# EAGLE design Battery pack (EAGLE 9.6.2)
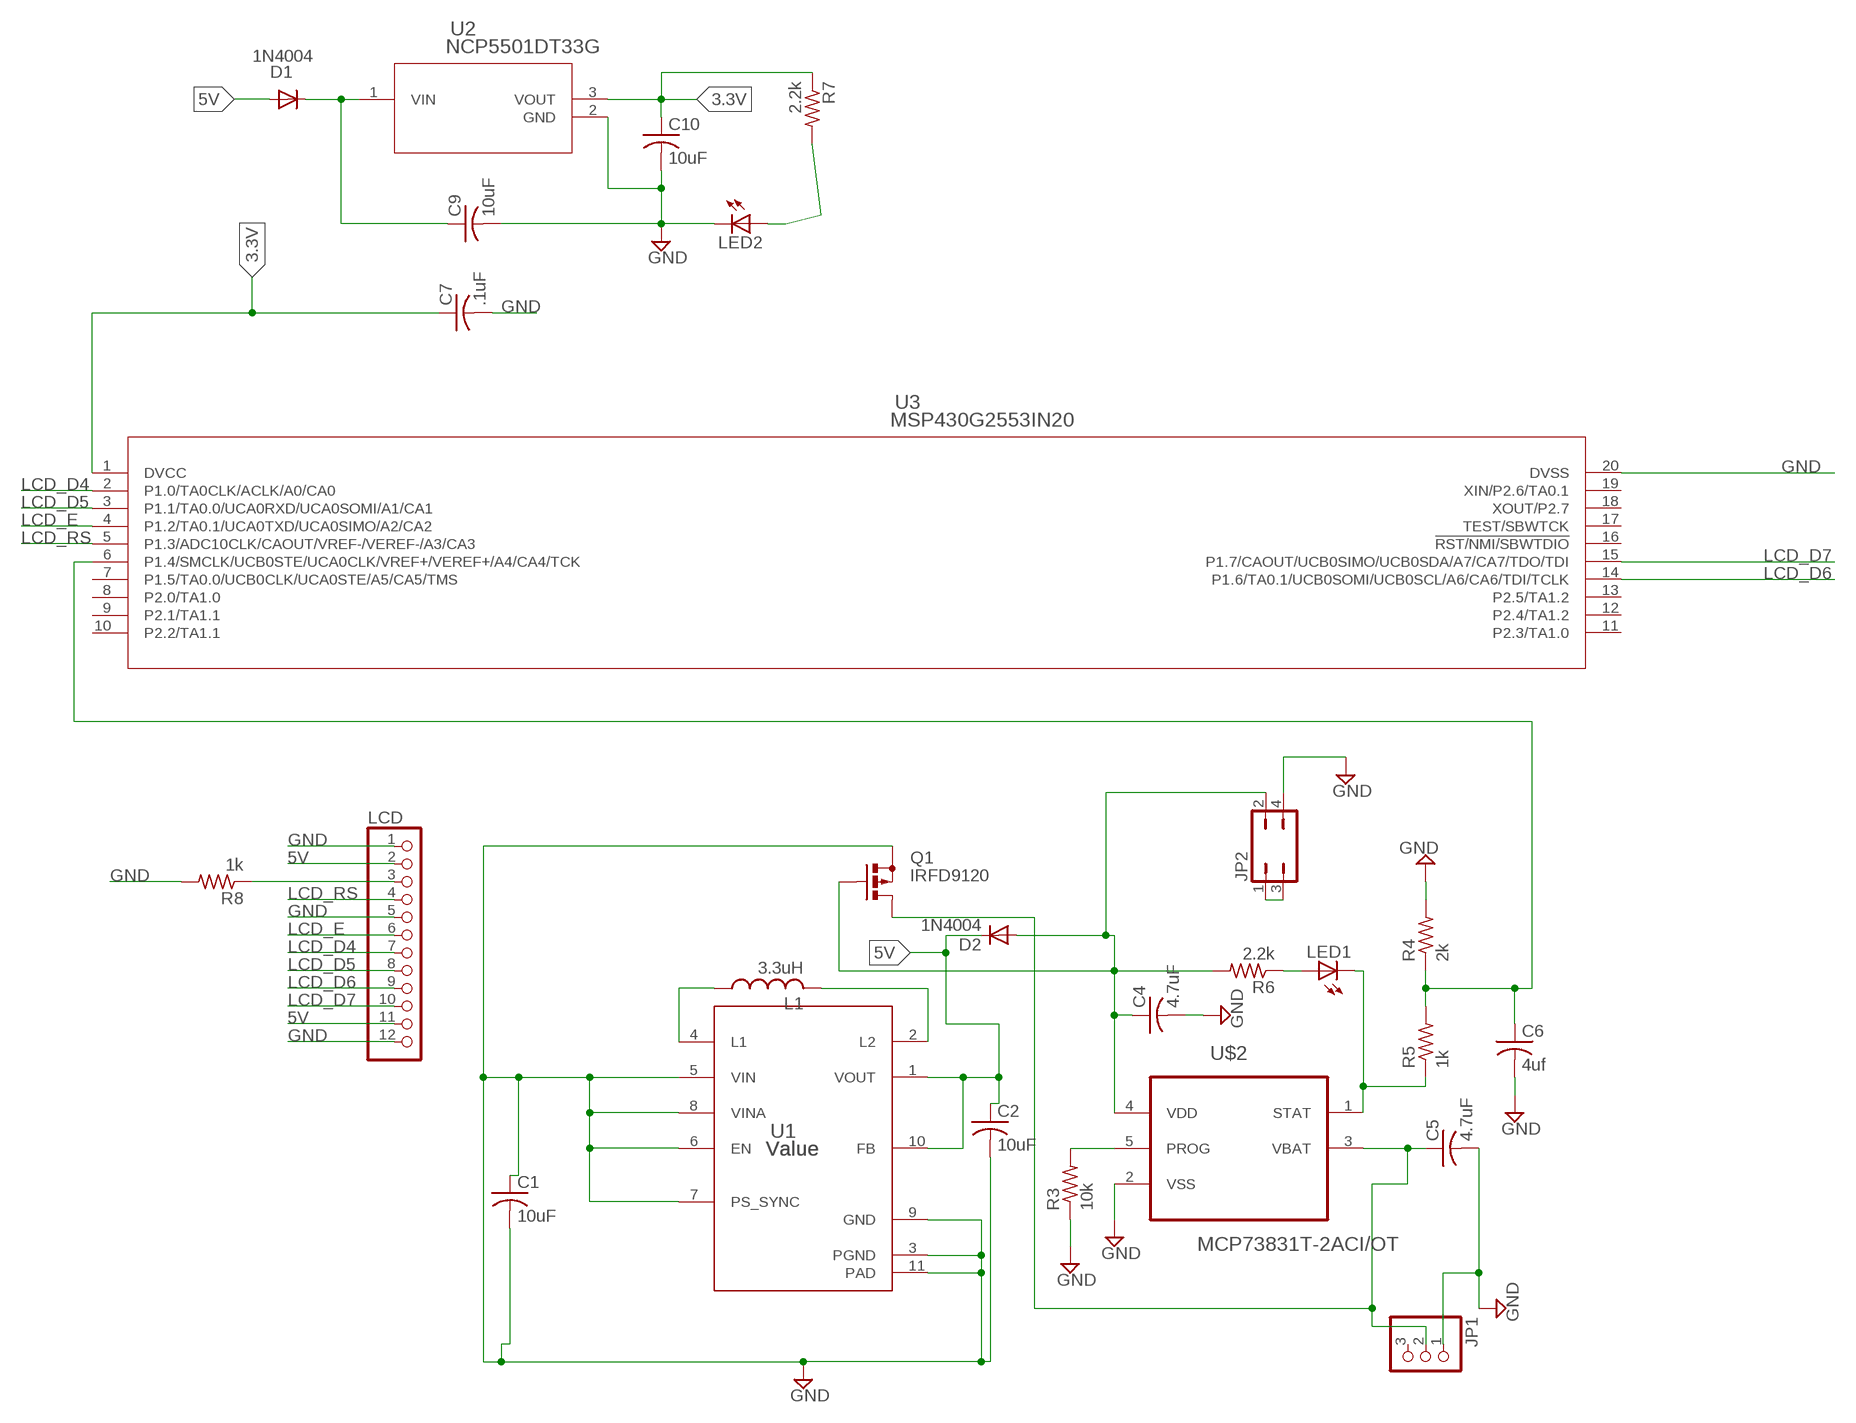
[diagram p0: schematic, sheet 1]

## Parts
C1  10uF  C-US150-064X183  [C150-064X183]
C2  10uF  C-US150-064X183  [C150-064X183]
C4  4.7uF  C-US150-064X183  [C150-064X183]
C5  4.7uF  C-US150-064X183  [C150-064X183]
C6  4uf  C-US150-064X183  [C150-064X183]
C7  .1uF  C-US150-064X183  [C150-064X183]
C9  10uF  C-US150-064X183  [C150-064X183]
C10  10uF  C-US150-064X183  [C150-064X183]
D1  1N4004  [DO41-10]
D2  1N4004  [DO41-10]
JP1  PINHD-1X3  [1X03]
JP2  JP2Q  [JP2Q]
L1  3.3uH  L-US0207/15  [0207/15]
LCD  PINHD-1X12  [1X12]
LED1  LEDB155  [Q62902-B155]
LED2  LEDB155  [Q62902-B155]
Q1  IRFD9120  [C370-01]
R3  10k  R-US_0207/15  [0207/15]
R4  2k  R-US_0207/15  [0207/15]
R5  1k  R-US_0207/15  [0207/15]
R6  2.2k  R-US_0207/15  [0207/15]
R7  2.2k  R-US_0207/15  [0207/15]
R8  1k  R-US_0207/15  [0207/15]
U1  Value  TPS63002DRCR  [DRC0010J]
U2  NCP5501DT33G  [DPAK-3_ONS]
U3  MSP430G2553IN20  [N20_TEX]
U$2  MCP73831T-2ACI/OT  [SOT95P280X145-5N]

## Nets
3.3V: C7.1 C10.1 R7.1 U2.3(VOUT) U3.1(DVCC)
5V: C2.1 D1.A D2.C LCD.2 LCD.11 U1.1(VOUT) U1.10(FB)
GND: C1.1 C1.2 C2.2 C4.2 C5.2 C6.2 C7.2 C9.2 C10.2 JP1.1 JP2.4 LCD.1 LCD.5 LCD.12 LED2.K(C) Q1.S R3.1 R4.2 R8.2 U1.3(PGND) U1.5(VIN) U1.6(EN) U1.7(PS_SYNC) U1.8(VINA) U1.9(GND) U1.11(PAD) U2.2(GND) U3.20(DVSS) U$2.2(VSS)
LCD_D4: LCD.7 U3.2(P1.0/TA0CLK/ACLK/A0/CA0)
LCD_D5: LCD.8 U3.3(P1.1/TA0.0/UCA0RXD/UCA0SOMI/A1/CA1)
LCD_D6: LCD.9 U3.14(P1.6/TA0.1/UCB0SOMI/UCB0SCL/A6/CA6/TDI/TCLK)
LCD_D7: LCD.10 U3.15(P1.7/CAOUT/UCB0SIMO/UCB0SDA/A7/CA7/TDO/TDI)
LCD_E: LCD.6 U3.4(P1.2/TA0.1/UCA0TXD/UCA0SIMO/A2/CA2)
LCD_RS: LCD.4 U3.5(P1.3/ADC10CLK/CAOUT/VREF-/VEREF-/A3/CA3)
N$1: L1.1 U1.4(L1)
N$2: C4.1 D2.A JP2.2 Q1.G R6.2 U$2.4(VDD)
N$3: JP2.1 JP2.3
N$4: L1.2 U1.2(L2)
N$6: C9.1 D1.C U2.1(VIN)
N$8: R3.2 U$2.5(PROG)
N$9: LED1.K(C) R5.1 U$2.1(STAT)
N$11: C6.1 R4.1 R5.2 U3.6(P1.4/SMCLK/UCB0STE/UCA0CLK/VREF+/VEREF+/A4/CA4/TCK)
N$12: LED1.A R6.1
N$14: C5.1 JP1.2 Q1.D Q1.D1(D) U$2.3(VBAT)
N$15: LED2.A R7.2
N$18: LCD.3 R8.1
Unconnected: JP1.3 U3.7(P1.5/TA0.0/UCB0CLK/UCA0STE/A5/CA5/TMS) U3.8(P2.0/TA1.0) U3.9(P2.1/TA1.1) U3.10(P2.2/TA1.1) U3.11(P2.3/TA1.0) U3.12(P2.4/TA1.2) U3.13(P2.5/TA1.2) U3.16(!RST/NMI/SBWTDIO) U3.17(TEST/SBWTCK) U3.18(XOUT/P2.7) U3.19(XIN/P2.6/TA0.1)

## Library data of the parts
C1 C2 C4-C7 C9 C10 = adafruit:C-US: CAPACITOR, American symbol
D1 D2 = adafruit:1N4004: DIODE General purpose 1N400x type rectifier (With bigger pads) http://www.ladyada.net/library/pcb/eaglelibrary.html
JP1 = adafruit:PINHD-1X3: PIN HEADER
JP2 = jumper:JP2Q: JUMPER
L1 = rcl:L-US: INDUCTOR, American symbol; SPICEPREFIX: L
LCD = adafruit:PINHD-1X12: PIN HEADER
LED1 LED2 = adafruit:LED: LED OSRAM: - CHIPLED LG R971, LG N971, LY N971, LG Q971, LY Q971, LO R971, LY R971 LH N974, LH R974 LS Q976, LO Q976, LY Q976 LO Q996 - Hyper CHIPLED LW Q18S LB Q993, LB Q99A, LB R99A - SideLED LS A670, LO A670, LY A670, LG A670, LP A670 LB A673, LV A673, LT A673, LW A673 LH A674 LY A675 LS A676, LA A676, LO A676, LY A676, LW A676 LS A679, LY A679, LG A679 - Hyper Micro SIDELED® LS Y876, LA Y876, LO Y876, LY Y876 LT Y87S - SmartLED LW L88C, LW L88S LB L89C, LB L89S, LG L890 LS L89K, LO L89K, LY L89K LS L896, LA L896, LO L896, LY L896 - TOPLED LS T670, LO T670, LY T670, LG T670, LP T670 LSG T670, LSP T670, LSY T670, LOP T670, LYG T670 LG T671, LOG T671, LSG T671 LB T673, LV T673, LT T673, LW T673 LH T674 LS T676, LA T676, LO T676, LY T676, LB T676, LH T676, LSB T676, LW T676 LB T67C, LV T67C, LT T67C, LS T67K, LO T67K, LY T67K, LW E67C LS E67B, LA E67B, LO E67B, LY E67B, LB E67C, LV E67C, LT E67C LW T67C LS T679, LY T679, LG T679 LS T770, LO T770, LY T770, LG T770, LP T770 LB T773, LV T773, LT T773, LW T773 LH T774 LS E675, LA E675, LY E675, LS T675 LS T776, LA T776, LO T776, LY T776, LB T776 LHGB T686 LT T68C, LB T68C - Hyper Mini TOPLED® LB M676 - Mini TOPLED Santana® LG M470 LS M47K, LO M47K, LY M47K Source: http://www.osram.convergy.de/
Q1 = transistor-small-signal:IRFD9120: P-CHANNEL MOS FET
R3-R8 = adafruit:R-US_: RESISTOR, American symbol
U1 = tps63002x:TPS63002DRCR; ALTERNATE_PARTNUMBER: TPS63002DRCT; APPLICATION_BUILDNUMBER: *; COMPTYPE: IC; MANUFACTURER: Texas Instruments; MOUNTTYPE: SMT; PACKAGEREFERENCE: DRC0010J; PARTNUMBER: TPS63002DRCR; PIN_COUNT: 11; REFDES: RefDes; ROHS: Y; TYPE: TYPE
U2 = NCP5501DT33G:NCP5501DT33G; COPYRIGHT: Copyright (C) 2016 Accelerated Designs. All rights reserved; MANUFACTURER_PART_NUMBER: NCP5501DT33G; SOURCELIBRARY: ONSemi_2017-12-12_4; VENDOR: ON Semiconductor
U3 = msp32pin:MSP430G2553IN20; BUILT_BY: EMA_UL_Team; MANUFACTURER_PART_NUMBER: MSP430G2553IN20; SOURCELIBRARY: TI_2016-12-05; VENDOR: Texas Instruments
U$2 = MCP73831T-2ACI_OT:MCP73831T-2ACI/OT: Charge Management Controller Check prices <https://pricing.snapeda.com/search/part/MCP73831T-2ACI/OT/?ref=eda>; AVAILABILITY: Good; DESCRIPTION: Charger IC Lithium Ion/Polymer SOT-23-5; MF: Microchip; MP: MCP73831T-2ACI/OT; PACKAGE: SOT-23 Microchip; PRICE: None; PURCHASE-URL: https://pricing.snapeda.com/search/part/MCP73831T-2ACI/OT/?ref=eda

## Board
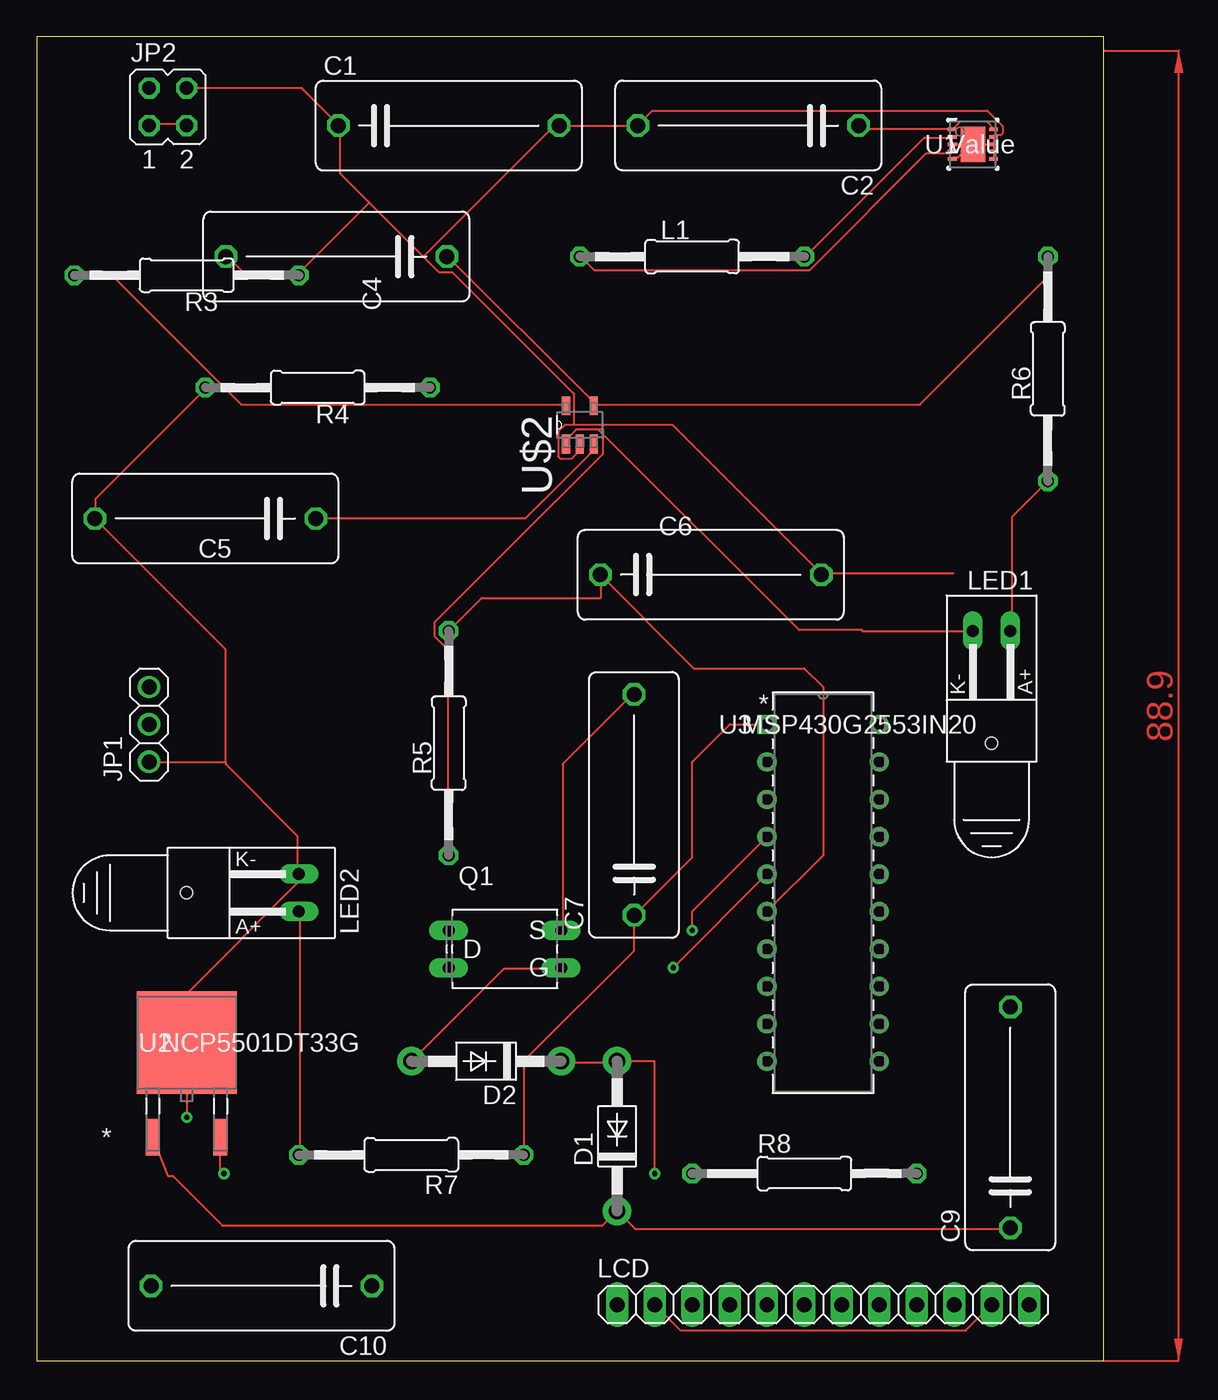
[diagram p1: board, top side]
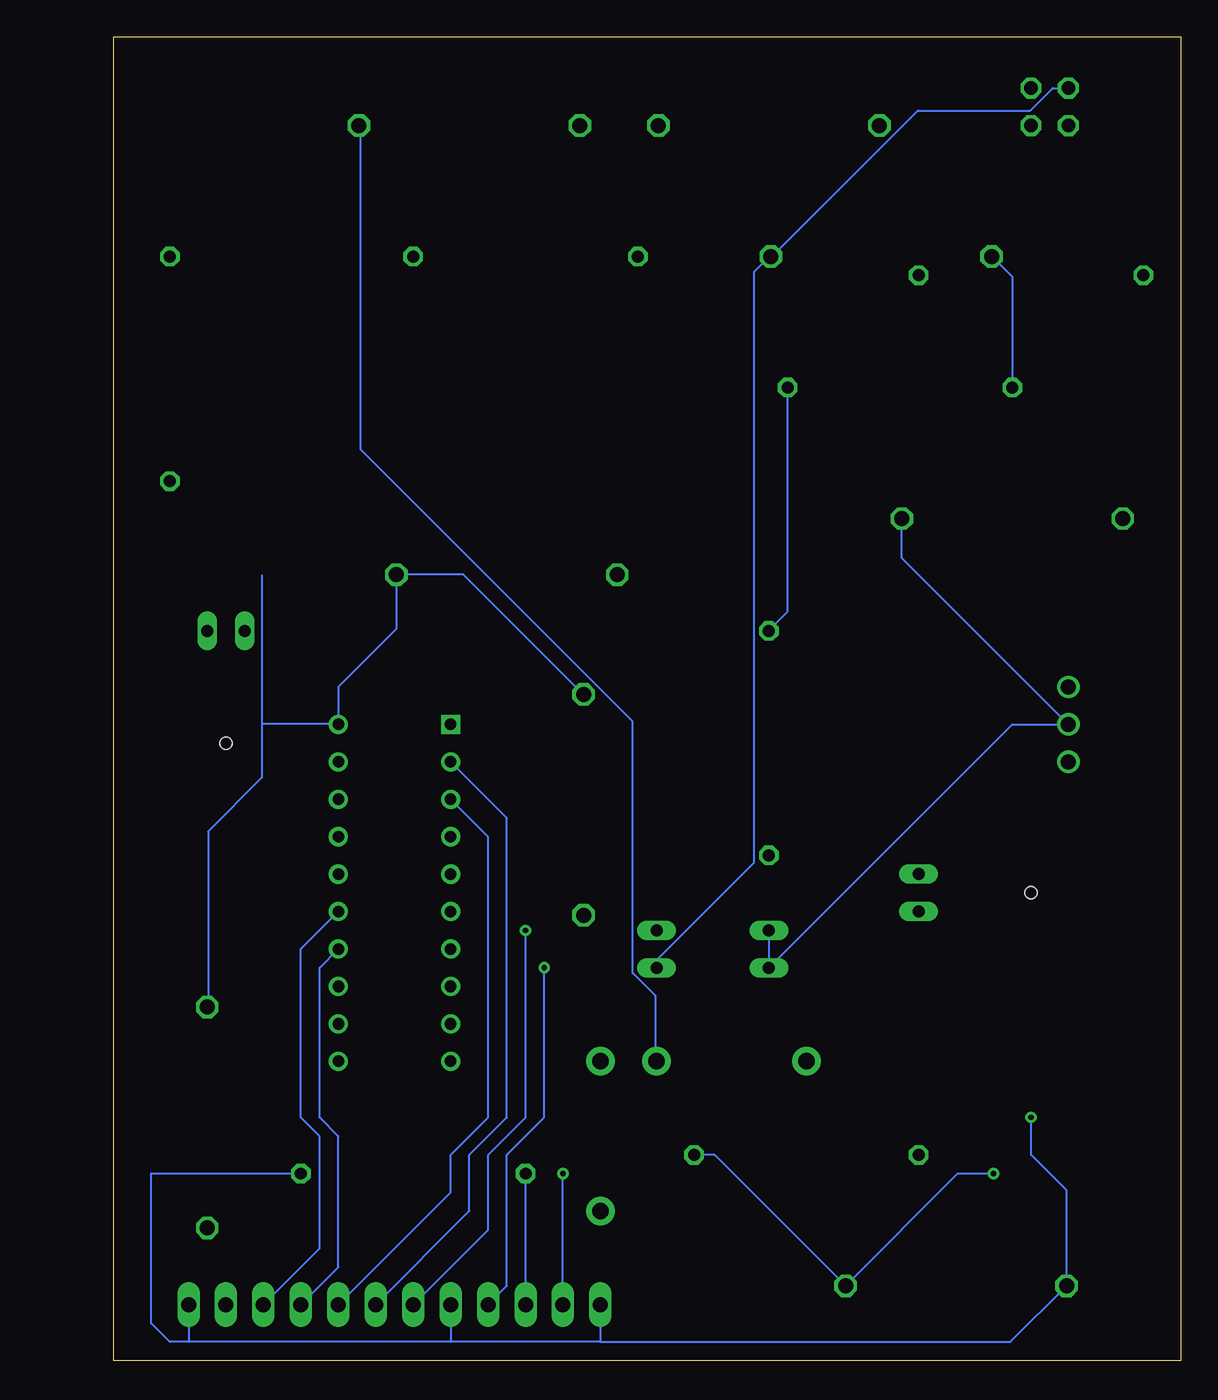
[diagram p2: board, bottom side, seen from below]

Size 72.37 x 89.84 mm. Coordinates in mm from the lower left corner, seen from the top.
Outline: 0,0 72.37,0 72.37,89.84 0,89.84 0,0
Copper layers (1*16): Top 0.035mm / dielectric 1.5mm / Bottom 0.035mm
Design rules "default": minimum track width 6mil, minimum drill 0.35mm, track to track 6mil, track to pad 6mil, pad to pad 6mil, via to via 6mil, smd to smd 6mil, copper to edge 40mil, drill to drill 6mil, minimum pad ring 10mil, minimum via ring 8mil, stop-mask expansion 4mil, vias tented up to drill 0mil, thermal gap 10mil

### Footprints (pad centres in the part's own frame; a part is rotated, then mirrored left to right if it is on the bottom)
C150-064X183 = drill 1.016 octagon: 1 -7.493,0; 2 7.493,0
DO41-10 = drill 1.118 pad 1.93: A 5.08,0; C -5.08,0
1X03 = drill 1.016: 1 -2.54,0; 2 0,0; 3 2.54,0
JP2Q = drill 0.914 octagon: 1 -1.27,-1.27; 2 -1.27,1.27; 3 1.27,-1.27; 4 1.27,1.27
0207/15 = drill 0.813 octagon: 1 -7.62,0; 2 7.62,0
1X12 = drill 1.016 long: 1 -13.97,0; 2 -11.43,0; 3 -8.89,0; 4 -6.35,0; 5 -3.81,0; 6 -1.27,0; 7 1.27,0; 8 3.81,0; 9 6.35,0; 10 8.89,0; 11 11.43,0; 12 13.97,0
Q62902-B155 = drill 0.813 long: A 7.62,-1.27; K 7.62,1.27 | hole 0.813: 0,0
C370-01 = drill 0.813 long: D -3.81,1.27; D1 -3.81,-1.27; G 3.81,-1.27; S 3.81,1.27
DRC0010J = smd 0.6 x 0.24: 1 -1.4,1; 2 -1.4,0.5; 3 -1.4,0; 4 -1.4,-0.5; 5 -1.4,-1; 6 1.4,-1; 7 1.4,-0.5; 8 1.4,0; 9 1.4,0.5; 10 1.4,1 | smd 1.65 x 2.4: 11 0,0 | smd 0.5 x 0.5: V 0,-0.95
DPAK-3_ONS = smd 0.94 x 2.489: 1 -2.29,-6.413; 3 2.29,-6.413 | smd 6.782 x 6.934: 2 0,0
N20_TEX = drill 0.787 pad 1.295 square: 1 0,0 | drill 0.787 pad 1.295: 2 0,-2.54; 3 0,-5.08; 4 0,-7.62; 5 0,-10.16; 6 0,-12.7; 7 0,-15.24; 8 0,-17.78; 9 0,-20.32; 10 0,-22.86; 11 7.62,-22.86; 12 7.62,-20.32; 13 7.62,-17.78; 14 7.62,-15.24; 15 7.62,-12.7; 16 7.62,-10.16; 17 7.62,-7.62; 18 7.62,-5.08; 19 7.62,-2.54; 20 7.62,0
SOT95P280X145-5N = smd 1.27 x 0.559: 1 -1.295,0.94; 2 -1.295,0; 3 -1.295,-0.94; 4 1.295,-0.94; 5 1.295,0.94

### Placement (x,y rotation side)
C1  27.94,83.82 0 top
C2  48.26,83.82 180 top
C4  20.32,74.93 180 top
C5  11.43,57.15 180 top
C6  45.72,53.34 0 top
C7  40.51,37.72 90 top
C9  66.04,16.51 90 top
C10  15.24,5.08 180 top
D1  39.37,15.24 90 top
D2  30.48,20.32 180 top
JP1  7.62,43.18 90 top
JP2  8.89,85.09 0 top
L1  44.45,74.93 0 top
LCD  53.34,3.81 0 top
LED1  64.77,41.91 90 top
LED2  10.16,31.75 0 top
Q1  31.75,27.94 0 top
R3  10.16,73.66 180 top
R4  19.05,66.04 180 top
R5  27.94,41.91 90 top
R6  68.58,67.31 90 top
R7  25.4,13.97 180 top
R8  52.07,12.7 0 top
U1  63.5,82.55 0 top
U2  10.16,21.59 0 top
U3  49.53,43.18 0 top
U$2  36.83,63.5 90 top

### Tracks (layer width: path | path; a pad name or v marks a point on that pad's centre or on a via)
3.3V  (via drill 0.35)
  Top 0.152: R7.1 33.07,13.97 33.07,20.37 40.51,27.81 C7.1 44.45,34.16 44.45,40.64 46.99,43.18 U3.1 | v12.7,12.7 12.45,12.95 U2.3
  Bottom 0.152: R7.1 31.62,13.97 C10.1 15.11,12.7 v12.7,12.7
5V  (via drill 0.35)
  Top 0.152: D2.C 35.66,20.22 39.27,20.22 D1.A 41.91,20.32 v41.91,12.7 | LCD.2 43.66,2.06 63.02,2.06 LCD.11 | U1.10 64.92,83.62 64.47,84.07 62.64,84.07 62.18,83.62 U1.1 62.03,83.62 55.93,83.62 55.78,83.77 C2.1
  Bottom 0.152: D2.C 35.66,20.37 35.66,24.79 37.19,26.31 37.19,43.38 55.63,61.82 55.63,83.77 C2.1 | LCD.2 v41.91,12.7
GND  (via drill 0.35)
  Top 0.152: 36.42,63.5 43.13,63.5 53.19,53.44 C6.2 53.34,53.44 62.18,53.44 | 36.42,63.5 35.81,63.5 35.36,63.04 35.36,61.37 35.51,61.21 36.27,61.21 36.73,61.67 36.73,62.13 U$2.2 | 17.68,33.02 17.68,35.61 12.8,40.49 12.8,40.64 | 17.68,33.02 17.68,32.41 10.21,24.94 10.21,21.59 U2.2 v10.16,16.51 | 17.68,33.02 LED2.K | 17.68,73.71 14.17,73.71 12.95,74.93 C4.2 | R4.2 11.43,65.94 3.96,58.47 3.96,57.25 C5.2 3.96,57.1 12.8,48.26 12.8,40.64 | 17.68,73.71 22.55,78.59 | 17.68,73.71 R3.1 | 36.42,63.5 36.42,65.63 28.19,73.86 27.28,73.86 26.21,74.93 | 22.55,78.59 26.21,74.93 | JP1.1 12.8,40.64 | U1.6 64.92,81.64 64.92,81.94 U1.7 64.92,82.09 64.92,82.55 | 64.92,82.55 64.92,83.01 U1.9 64.92,83.16 65.38,83.16 65.53,83.31 65.53,83.77 64.47,84.84 41.76,84.84 40.84,83.92 C2.2 40.69,83.77 35.51,83.77 C1.2 35.36,83.77 35.05,83.77 26.21,74.93 | 64.92,82.55 U1.8 U1.11 | 62.94,82.09 63.4,82.55 U1.11 | 62.94,82.09 62.48,81.64 62.18,81.64 U1.5 | U1.3 62.48,82.55 62.94,82.09 | 62.94,82.09 U1.11 | Q1.S 35.66,29.21 35.66,40.49 40.39,45.21 C7.2 | JP2.4 17.98,86.36 20.42,83.92 C1.1 20.57,83.77 20.57,80.57 22.55,78.59
  Bottom 0.152: 62.33,53.29 62.33,43.23 | 62.33,43.23 62.33,39.57 65.99,35.92 65.99,24.03 C9.2 | R4.2 11.43,73.56 12.8,74.93 C4.2 | 39.37,1.27 11.56,1.27 C10.2 7.75,11.56 10.16,13.97 v10.16,16.51 | R8.2 69.85,12.7 69.85,2.54 68.58,1.27 67.31,1.27 | 39.37,1.27 49.53,1.27 | 49.53,1.27 67.31,1.27 | LCD.12 67.31,1.27 | LCD.1 39.37,1.27 | LCD.5 49.53,1.27 | 57.15,43.23 57.15,45.72 53.21,49.66 C6.2 48.64,53.34 48.62,53.29 40.54,45.21 C7.2 | 35.66,29.21 Q1.S | 62.33,43.23 57.15,43.23 | 57.15,43.23 U3.20
LCD_D4
  Bottom 0.152: LCD.7 48.26,10.16 48.26,13.97 45.72,16.51 45.72,36.83 U3.2
LCD_D5
  Bottom 0.152: LCD.8 49.53,11.43 49.53,13.97 46.99,16.51 46.99,35.56 U3.3
LCD_D6
  Bottom 0.152: LCD.9 57.15,6.35 57.15,15.24 58.42,16.51 58.42,26.67 U3.14
LCD_D7
  Bottom 0.152: LCD.10 58.42,7.62 58.42,15.24 59.69,16.51 59.69,27.94 U3.15
LCD_E  (via drill 0.35)
  Top 0.152: v44.45,29.21 44.45,30.48 U3.4
  Bottom 0.152: LCD.6 46.99,8.89 46.99,13.97 44.45,16.51 v44.45,29.21
LCD_RS  (via drill 0.35)
  Top 0.152: v43.18,26.67 U3.5
  Bottom 0.152: LCD.4 45.72,5.08 45.72,13.97 43.18,16.51 v43.18,26.67
N$1
  Top 0.152: U1.4 62.03,81.94 60.35,81.94 52.43,74.02 37.8,74.02 36.88,74.93 L1.1
N$2
  Top 0.152: D2.A 31.7,26.62 35.51,26.62 Q1.G | C4.1 27.89,74.93 37.64,65.18 37.64,64.87 U$2.4 37.8,64.87 59.89,64.87 68.58,73.56 R6.2
  Bottom 0.152: Q1.G 35.51,26.77 35.51,27.23 28.96,33.78 28.96,73.86 27.89,74.93 C4.1 27.74,74.93 17.83,84.84 10.21,84.84 8.69,86.36 JP2.2
N$3
  Top 0.152: JP2.1 7.62,83.92 10.06,83.92 JP2.3
N$4
  Top 0.152: U1.2 62.03,83.01 60.2,83.01 52.12,74.93 L1.2
N$6
  Top 0.152: U2.1 8.92,12.5 9.25,12.5 12.6,9.14 38.35,9.14 D1.C 40.59,8.94 65.99,8.94 C9.1
N$8
  Top 0.152: U$2.5 35.81,64.87 13.87,64.87 5.18,73.56 2.59,73.56 R3.2
N$9
  Top 0.152: 38.1,63.2 38.41,63.2 38.41,61.52 26.98,50.09 26.98,49.17 27.89,48.26 27.89,34.39 R5.1 | 38.1,63.2 36.58,63.2 35.97,62.59 35.97,62.28 U$2.1 | 38.1,63.2 51.71,49.58 55.98,49.58 56.01,49.53 LED1.K
N$11
  Top 0.152: R5.2 30.18,51.77 38.25,51.77 38.25,53.29 C6.1 44.58,46.99 52.07,46.99 53.34,45.72 53.34,34.29 U3.6
  Bottom 0.152: R4.1 26.67,50.85 27.89,49.63 R5.2
N$12
  Top 0.152: R6.1 66.14,57.25 66.14,49.58 LED1.A
N$14
  Top 0.152: U$2.3 37.64,62.13 37.64,61.67 33.12,57.15 C5.1
  Bottom 0.152: Q1.D Q1.D1 11.43,43.18 JP1.2 18.92,54.48 C5.1
N$15
  Top 0.152: R7.2 17.83,13.97 17.83,30.43 LED2.A
N$18
  Bottom 0.152: LCD.3 R8.1
(copper drawn outside any net)
  shapes: Top area x1